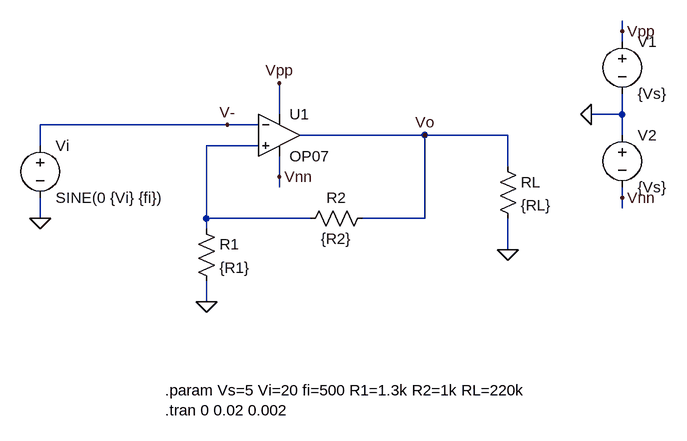
[diagram p0: schematic Q11.asc]
Q11.asc, the LTspice schematic file:
Version 4.1
SHEET 1 880 680
WIRE 672 -64 672 -80
WIRE 672 -48 672 -64
WIRE 144 64 144 16
WIRE 672 64 672 32
WIRE 672 64 624 64
WIRE 64 80 -224 80
WIRE 112 80 64 80
WIRE 368 96 176 96
WIRE 496 96 368 96
WIRE 672 96 672 64
WIRE -224 112 -224 80
WIRE 112 112 32 112
WIRE 496 144 496 96
WIRE 144 160 144 128
WIRE 144 176 144 160
WIRE 672 192 672 176
WIRE 672 208 672 192
WIRE -224 224 -224 192
WIRE 32 224 32 112
WIRE 192 224 32 224
WIRE 368 224 368 96
WIRE 368 224 272 224
WIRE 32 240 32 224
WIRE 496 272 496 224
WIRE 32 352 32 320
FLAG 144 16 Vpp
FLAG 144 160 Vnn
FLAG -224 224 0
FLAG 64 80 V-
FLAG 32 352 0
FLAG 496 272 0
FLAG 624 64 0
FLAG 672 -64 Vpp
FLAG 672 192 Vnn
FLAG 368 96 Vo
SYMBOL OpAmps\\OP07 144 32 R0
SYMATTR InstName U1
SYMBOL voltage -224 96 R0
SYMATTR InstName Vi
SYMATTR Value SINE(0 {Vi} {fi})
SYMBOL res 16 224 R0
SYMATTR InstName R1
SYMATTR Value {R1}
SYMBOL res 288 208 R90
WINDOW 0 0 56 VBottom 2
WINDOW 3 32 56 VTop 2
SYMATTR InstName R2
SYMATTR Value {R2}
SYMBOL res 480 128 R0
SYMATTR InstName RL
SYMATTR Value {RL}
SYMBOL voltage 672 -64 R0
SYMATTR InstName V1
SYMATTR Value {Vs}
SYMBOL voltage 672 80 R0
SYMATTR InstName V2
SYMATTR Value {Vs}
TEXT -32 488 Left 2 !.param Vs=5 Vi=20 fi=500 R1=1.3k R2=1k RL=220k\n.tran 0 0.02 0.002

The netlist it stands for:
* Q11.asc
X§U1 N001 V- Vpp Vnn Vo LT1001  ; OP07, pins In+ In- V+ V- OUT
Vi V- 0 SINE(0 {Vi} {fi})
R1 N001 0 {R1}
R2 Vo N001 {R2}
RL Vo 0 {RL}
V1 Vpp 0 {Vs}
V2 0 Vnn {Vs}
.param Vs=5 Vi=20 fi=500 R1=1.3k R2=1k RL=220k
.tran 0 0.02 0.002
.lib LTC.lib
.backanno
.end